# Altium schematic sheet HDMI.SchDoc
size A4
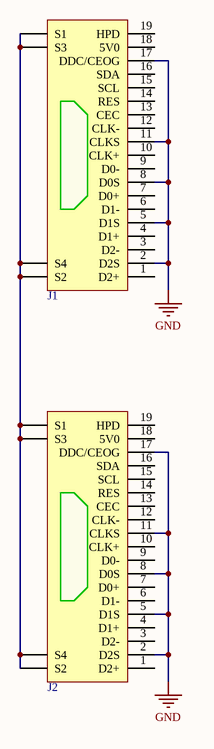
[diagram p0: HDMI.SchDoc]

## Parts
J1  HDMI  (value not drawn)
J2  HDMI  (value not drawn)

## Nets
GND: J1.2(D2S) J1.5(D1S) J1.8(D0S) J1.11(CLKS) J1.17(DDC/CEOG) J2.2(D2S) J2.5(D1S) J2.8(D0S) J2.11(CLKS) J2.17(DDC/CEOG)
NetJ1_?1: J1.?1(S1) J1.?2(S2) J1.?3(S3) J1.?4(S4) J2.?1(S1) J2.?2(S2) J2.?3(S3) J2.?4(S4)

Not connected (* = marked no-connect by the designer): J1 1(D2+) 3(D2-) 4(D1+) 6(D1-) 7(D0+) 9(D0-) 10(CLK+) 12(CLK-) 13(CEC) 14(RES) 15(SCL) 16(SDA) 18(5V0) 19(HPD); J2 1(D2+) 3(D2-) 4(D1+) 6(D1-) 7(D0+) 9(D0-) 10(CLK+) 12(CLK-) 13(CEC) 14(RES) 15(SCL) 16(SDA) 18(5V0) 19(HPD)